# Altium schematic sheet Single_Matrix.SchDoc
size A4; Author: Jan Rutkowski; CompanyName: AGH; SheetNumber: 2; SheetTotal: 2
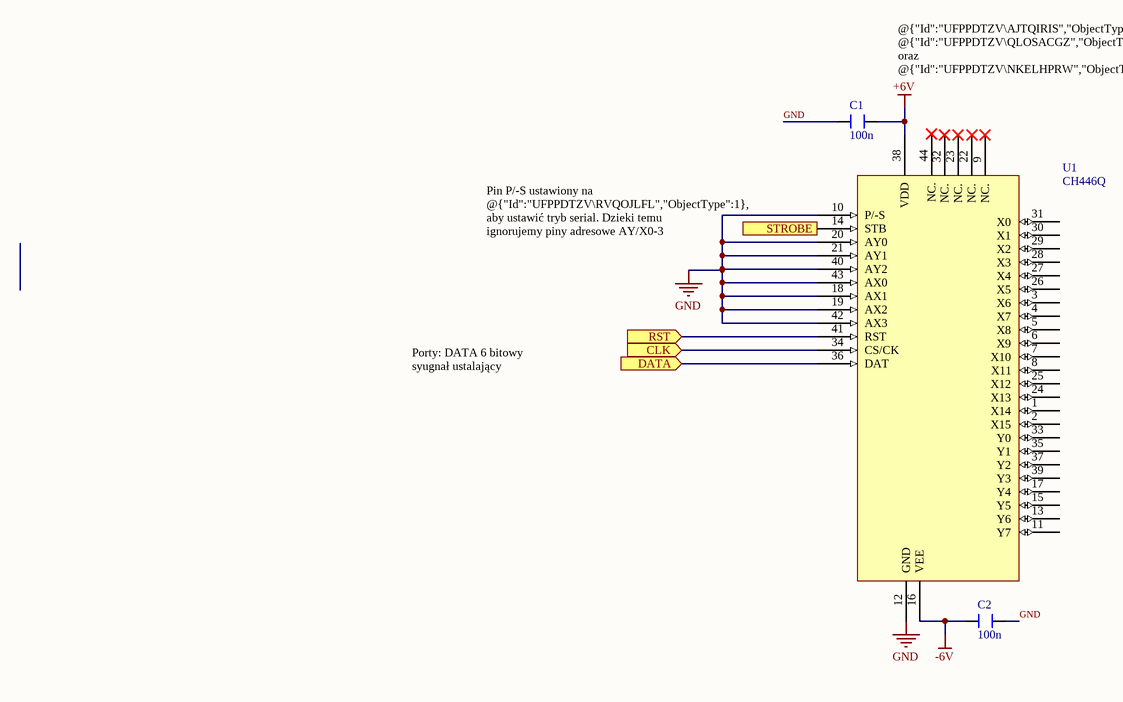
[diagram p0: Single_Matrix.SchDoc]

## Parts
C1  100n  [CL10B104KB8NNNC]
C2  100n  [CL10B104KB8NNNC]
U1  CH446Q  [LQFP-44_CH446Q]

## Ports
CLK (in), DATA (in), RST (in), STROBE (in)

## Nets
+6V: C1.8 U1.38(VDD)
-6V: C2.7 U1.16(VEE)
GND: C1.7 C2.8 U1.10(P/-S) U1.12(GND) U1.18(AX1) U1.19(AX2) U1.20(AY0) U1.21(AY1) U1.40(AY2) U1.42(AX3) U1.43(AX0)
CLK: U1.34(CS/CK) ; port CLK
DATA: U1.36(DAT) ; port DATA
RST: U1.41(RST) ; port RST
STROBE: U1.14(STB) ; port STROBE

Not connected (* = marked no-connect by the designer): U1 1(X14) 2(X15) 3(X6) 4(X7) 5(X8) 6(X9) 7(X10) 8(X11) 9(NC.)* 11(Y7) 13(Y6) 15(Y5) 17(Y4) 22(NC.)* 23(NC.)* 24(X13) 25(X12) 26(X5) 27(X4) 28(X3) 29(X2) 30(X1) 31(X0) 32(NC.)* 33(Y0) 35(Y1) 37(Y2) 39(Y3) 44(NC.)*

## Notes on the sheet
- @{"Id":"UFPPDTZV\AJTQIRIS","ObjectType":1}, @{"Id":"UFPPDTZV\QLOSACGZ","ObjectType":1} oraz @{"Id":"UFPPDTZV\NKELHPRW","ObjectType":2} oraz @{"Id":"UFPPDTZV\TWNOWIRV","ObjectType":2} ustawione według zaleceń producenta. Do zmiany jesli zespól zasilania ustali inaczej.
- Pin P/-S ustawiony na @{"Id":"UFPPDTZV\RVQOJLFL","ObjectType":1}, aby ustawić tryb serial. Dzieki temu ignorujemy piny adresowe AY/X0-3
- Porty: DATA 6 bitowy syugnał ustalający połączenie, STROBE indywidualny włącznik dla każdej matrycy, to one bedą podpięte do pinów mikrokontrolera, CLK zegar dla przerzutników, RST reset
- Text
- Company Confidential / Not for distribution
- Project name:
- Document Name:
- Free Documents
- Sheet1.SchDoc
- Designer Name:
- Jan Rutkowski
- Date/Time:
- 10.03.26
- Revison:
- 1

## Library data of the parts
C1 C2 = CL10B104KB8NNNC: Capacitor SMD 0603 100n to VDD, VBAT, VDDA, VREF+, VDDUSB, NRST; ComponentLink1Description: New link; ComponentLink1URL: *; Supplier 1: RS; Supplier Part Number 1: 7665443
U1 = CH446Q: Analog Switch Array